# Altium schematic sheet [14]-RTC.SchDoc
size A4
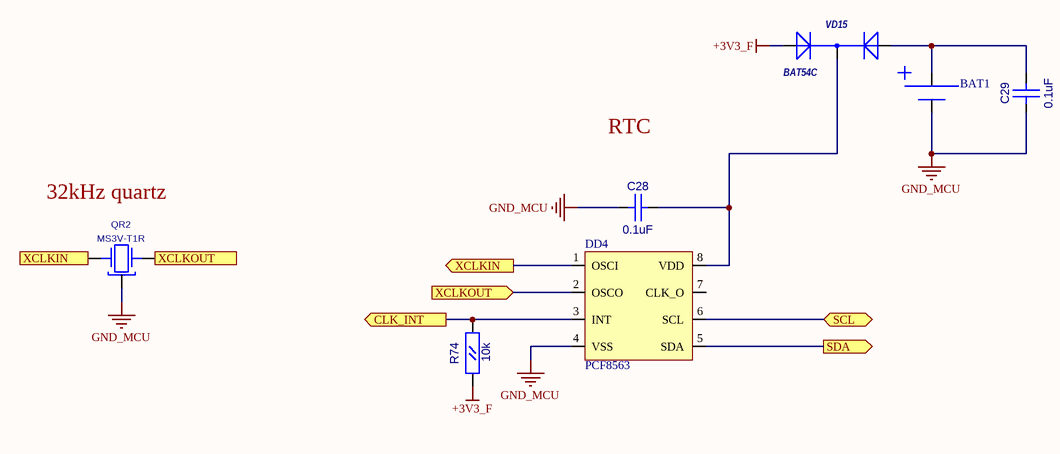
[diagram p0: [14]-RTC.SchDoc]

## Parts
BAT1  CR2032-VBY4  [CR2032_ONBOARD]  (value not drawn)
C28  0.1uF  [CC0603]
C29  0.1uF  [CC0603]
DD4  PCF8563  [SO-8]
QR2  MS3V-T1R  [MS3V-T1R]
R74  10k  [RC0603]
VD15  BAT54C  [SOT-23(123)]

## Ports
CLK_INT (out), SCL (bidir), SDA (out), XCLKIN (in), XCLKIN (out), XCLKOUT (in), XCLKOUT (out)

## Nets
+3V3_F: R74.1(A) VD15.1(A)
GND_MCU: BAT1.1 C28.1(A) C29.1(A) DD4.4(VSS) QR2.3
CLK_INT: DD4.3(INT) R74.2(B) ; port CLK_INT
SCL: DD4.6(SCL) ; port SCL
SDA: DD4.5(SDA) ; port SDA
XCLKIN: DD4.1(OSCI) QR2.2(X2) ; port XCLKIN
XCLKOUT: DD4.2(OSCO) QR2.1(X1) ; port XCLKOUT
NetBAT1_2: BAT1.2 C29.2(B) VD15.2(A)
NetC28_2: C28.2(B) DD4.8(VDD) VD15.3(K)

Not connected (* = marked no-connect by the designer): DD4 7(CLK_O)

## Notes on the sheet
- RTC
- (near QR2) 32kHz quartz

## Library data of the parts
BAT1 = CR2032-VBY2: Value: CR2032-VBY4
C28 C29 = CC0603: Value: 0.1uF
QR2 = MS3V-T1R: CRYSTAL_32768 Hz; Value: MS3V-T1R
R74 = RC0603: Value: 10k
DD4 = PCF8563: Value: PCF8563
VD15 = BAT54C: Value: *